# EAGLE design Session 3 Task_V3 (EAGLE 9.6.2)
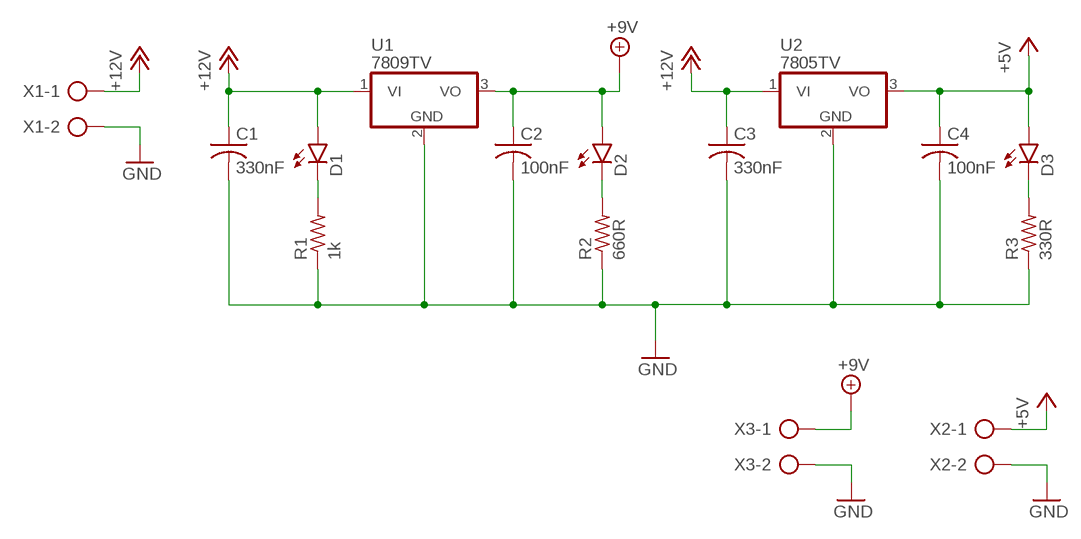
[diagram p0: schematic, sheet 1]

## Parts
C1  330nF  C-US025-024X044  [C025-024X044]
C2  100nF  C-US025-024X044  [C025-024X044]
C3  330nF  C-US025-024X044  [C025-024X044]
C4  100nF  C-US025-024X044  [C025-024X044]
D1  LED5MM  [LED5MM]
D2  LED5MM  [LED5MM]
D3  LED5MM  [LED5MM]
R1  1k  R-US_0204/7  [0204/7]
R2  660R  R-US_0204/7  [0204/7]
R3  330R  R-US_0204/7  [0204/7]
U1  7809TV  7805TV  [TO220V]
U2  7805TV  [TO220V]
X1  AK500/2  [AK500/2]
X2  AK500/2  [AK500/2]
X3  AK500/2  [AK500/2]

## Nets
+5V: C4.1 D3.A U2.3(VO) X2.1
+9V: C2.1 D2.A U1.3(VO) X3.1
+12V: C1.1 C3.1 D1.A U1.1(VI) U2.1(VI) X1.1
GND: C1.2 C2.2 C3.2 C4.2 R1.1 R2.1 R3.1 U1.2(GND) U2.2(GND) X1.2 X2.2 X3.2
N$1: D2.K(C) R2.2
N$2: D1.K(C) R1.2
N$3: D3.K(C) R3.2

## Library data of the parts
C1-C4 = rcl:C-US: CAPACITOR, American symbol; SPICEPREFIX: C
D1-D3 = led:LED: LED OSRAM: - CHIPLED LG R971, LG N971, LY N971, LG Q971, LY Q971, LO R971, LY R971 LH N974, LH R974 LS Q976, LO Q976, LY Q976 LO Q996 - Hyper CHIPLED LW Q18S LB Q993, LB Q99A, LB R99A - SideLED LS A670, LO A670, LY A670, LG A670, LP A670 LB A673, LV A673, LT A673, LW A673 LH A674 LY A675 LS A676, LA A676, LO A676, LY A676, LW A676 LS A679, LY A679, LG A679 - Hyper Micro SIDELED® LS Y876, LA Y876, LO Y876, LY Y876 LT Y87S - SmartLED LW L88C, LW L88S LB L89C, LB L89S, LG L890 LS L89K, LO L89K, LY L89K LS L896, LA L896, LO L896, LY L896 - TOPLED LS T670, LO T670, LY T670, LG T670, LP T670 LSG T670, LSP T670, LSY T670, LOP T670, LYG T670 LG T671, LOG T671, LSG T671 LB T673, LV T673, LT T673, LW T673 LH T674 LS T676, LA T676, LO T676, LY T676, LB T676, LH T676, LSB T676, LW T676 LB T67C, LV T67C, LT T67C, LS T67K, LO T67K, LY T67K, LW E67C LS E67B, LA E67B, LO E67B, LY E67B, LB E67C, LV E67C, LT E67C LW T67C LS T679, LY T679, LG T679 LS T770, LO T770, LY T770, LG T770, LP T770 LB T773, LV T773, LT T773, LW T773 LH T774 LS E675, LA E675, LY E675, LS T675 LS T776, LA T776, LO T776, LY T776, LB T776 LHGB T686 LT T68C, LB T68C - Hyper Mini TOPLED® LB M676 - Mini TOPLED Santana® LG M470 LS M47K, LO M47K, LY M47K Source: http://www.osram.convergy.de LUXEON: - LUMILED® LXK2-PW12-R00, LXK2-PW12-S00, LXK2-PW14-U00, LXK2-PW14-V00 LXK2-PM12-R00, LXK2-PM12-S00, LXK2-PM14-U00 LXK2-PE12-Q00, LXK2-PE12-R00, LXK2-PE12-S00, LXK2-PE14-T00, LXK2-PE14-U00 LXK2-PB12-K00, LXK2-PB12-L00, LXK2-PB12-M00, LXK2-PB14-N00, LXK2-PB14-P00, LXK2-PB14-Q00 LXK2-PR12-L00, LXK2-PR12-M00, LXK2-PR14-Q00, LXK2-PR14-R00 LXK2-PD12-Q00, LXK2-PD12-R00, LXK2-PD12-S00 LXK2-PH12-R00, LXK2-PH12-S00 LXK2-PL12-P00, LXK2-PL12-Q00, LXK2-PL12-R00 Source: www.luxeon.com KINGBRIGHT: KA-3528ASYC Source: www.kingbright.com
R1-R3 = rcl:R-US_: RESISTOR, American symbol; SPICEPREFIX: R
U1 U2 = linear:78*: Positive VOLTAGE REGULATOR Source: http://cache.national.com/ds/LM/LM78L05.pdf http://www.fairchildsemi.com/ds/LM/LM7805.pdf
X1-X3 = con-ptr500:AK500/2: CONNECTOR; OC_FARNELL: unknown; OC_NEWARK: unknown

## Board
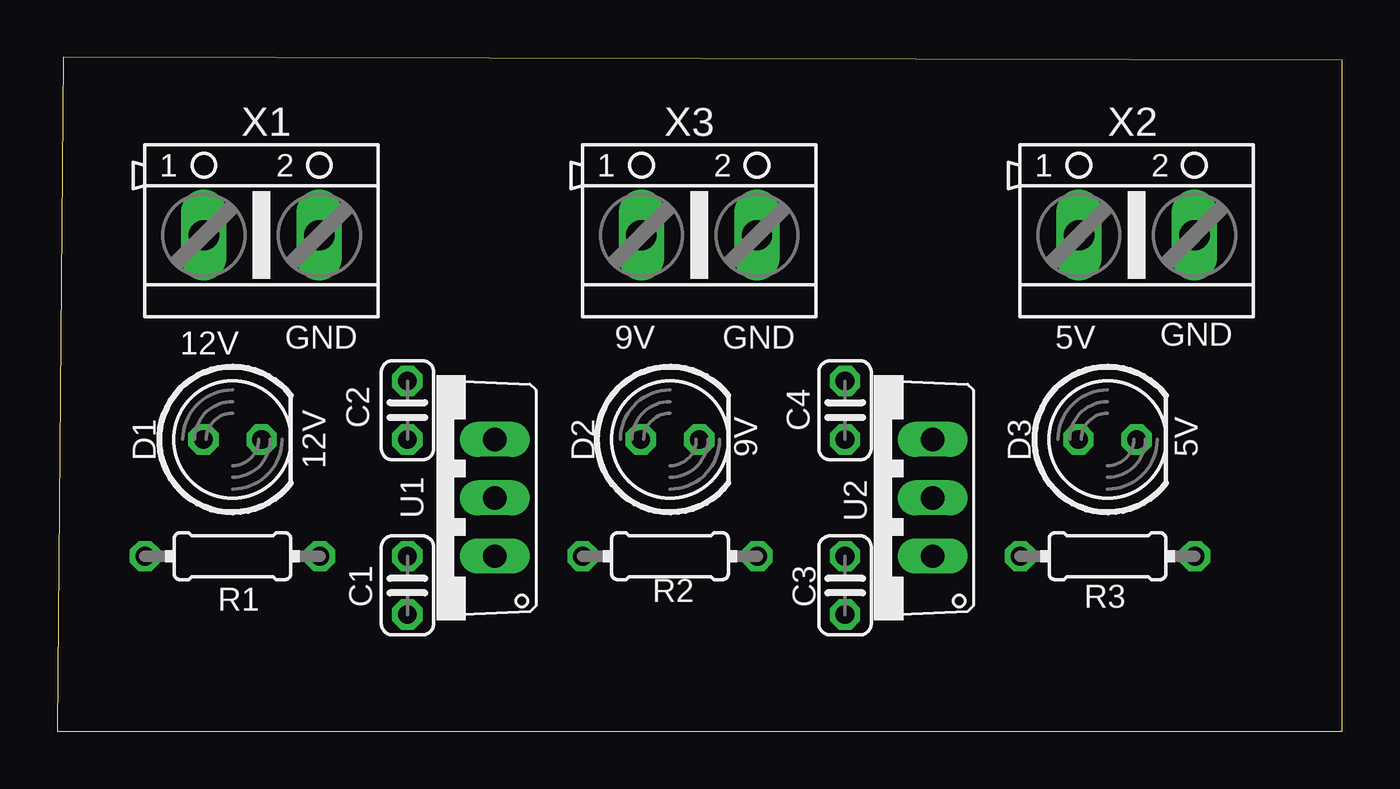
[diagram p1: board, top side]
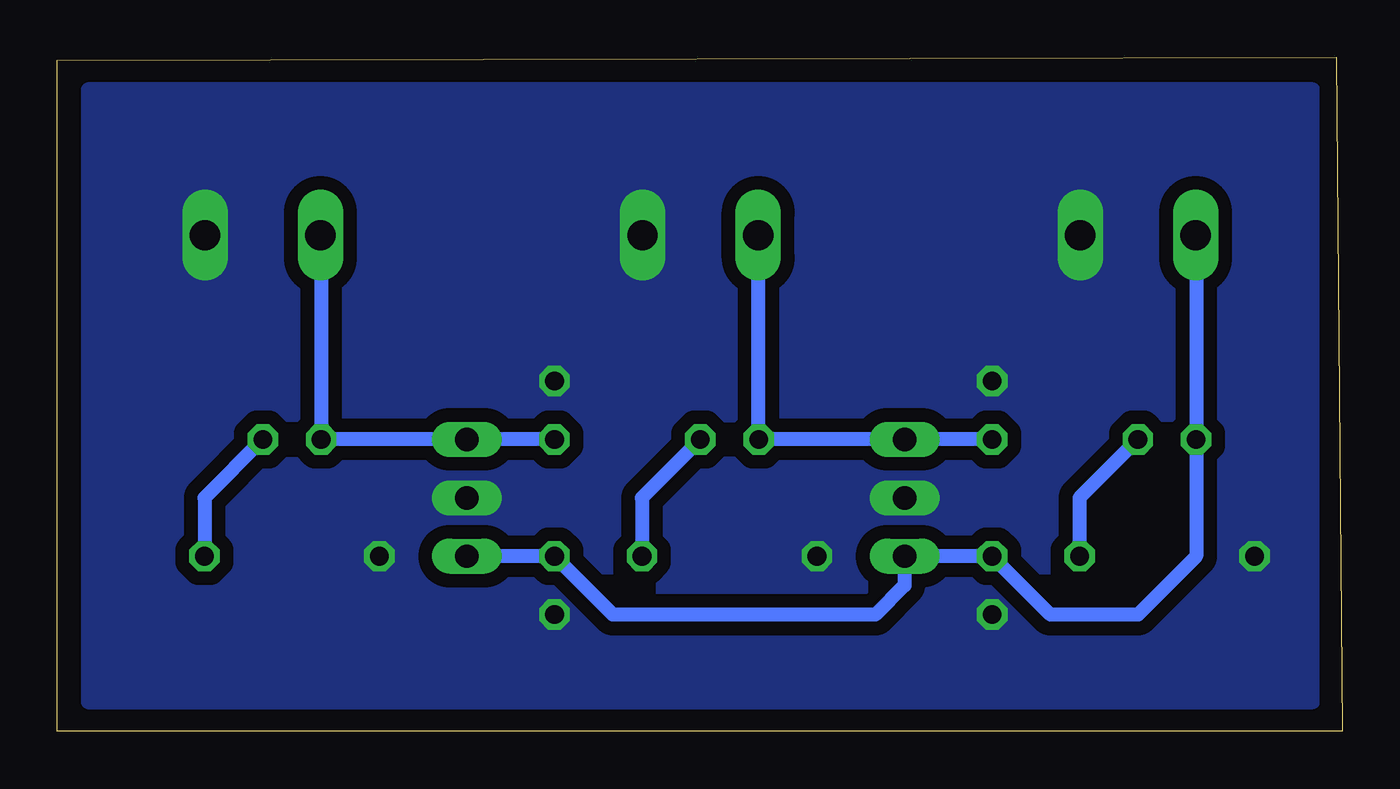
[diagram p2: board, bottom side, seen from below]

Size 55.93 x 29.33 mm. Coordinates in mm from the lower left corner, seen from the top.
Outline: 0,0 55.93,0 55.93,29.2 0.25,29.33 0,0
Copper layers (1*16): Top 0.035mm / dielectric 1.5mm / Bottom 0.035mm
Design rules "default *": minimum track width 0.6mm, minimum drill 0.6mm, track to track 0.6mm, track to pad 0.6mm, pad to pad 0.6mm, via to via 0.6mm, smd to smd 6mil, copper to edge 0.6mm, drill to drill 0.6mm, minimum pad ring 10mil, minimum via ring 8mil, stop-mask expansion 4mil, vias tented up to drill 0mil, thermal gap 10mil

### Footprints (pad centres in the part's own frame; a part is rotated, then mirrored left to right if it is on the bottom)
C025-024X044 = drill 0.813 octagon: 1 -1.27,0; 2 1.27,0
LED5MM = drill 0.813 octagon: A -1.27,0; K 1.27,0
0204/7 = drill 0.813 octagon: 1 -3.81,0; 2 3.81,0
TO220V = drill 1.016 long: 1 -2.54,-2.54; 2 0,-2.54; 3 2.54,-2.54
AK500/2 = drill 1.321 long: 1 -2.515,0; 2 2.515,0

### Placement (x,y rotation side)
C1  15.24,6.35 270 top
C2  15.24,13.97 90 top
C3  34.29,6.35 270 top
C4  34.29,13.97 90 top
D1  7.62,12.7 0 top
D2  26.67,12.7 0 top
D3  45.72,12.7 0 top
R1  7.62,7.62 0 top
R2  26.67,7.62 0 top
R3  45.72,7.62 0 top
U1  16.51,10.16 90 top
U2  35.56,10.16 90 top
X1  8.89,21.59 0 top
X2  46.99,21.59 0 top
X3  27.94,21.59 0 top

### Tracks (layer width: path | path; a pad name or v marks a point on that pad's centre or on a via)
+5V
  Bottom 0.6: C4.1 U2.3 D3.A 44.45,21.57 X2.1
+9V
  Bottom 0.6: C2.1 U1.3 D2.A 25.4,21.57 X3.1
+12V
  Bottom 0.6: X1.1 6.35,21.57 D1.A 6.35,7.62 8.89,5.08 12.7,5.08 C1.1 U1.1 19.05,6.35 20.32,5.08 31.75,5.08 C3.1 U2.1
GND
  pour Bottom (rank 2, no thermals): 1.27,27.94 54.61,27.94 54.61,1.27 1.27,1.27
N$1
  Bottom 0.6: D2.K 30.48,10.16 R2.2
N$2
  Bottom 0.6: D1.K 11.43,10.16 R1.2
N$3
  Bottom 0.6: D3.K 49.53,10.16 R3.2

### Text on the board
tPlace: GND | 12V | GND | 9V | GND | 5V | 9V | 5V | 12V
tValues: 100nF | 100nF | 330nF | 660R | 330nF | 330R | 1k